# EAGLE design pcb-breakout-pan1740 (EAGLE 7.4.0)
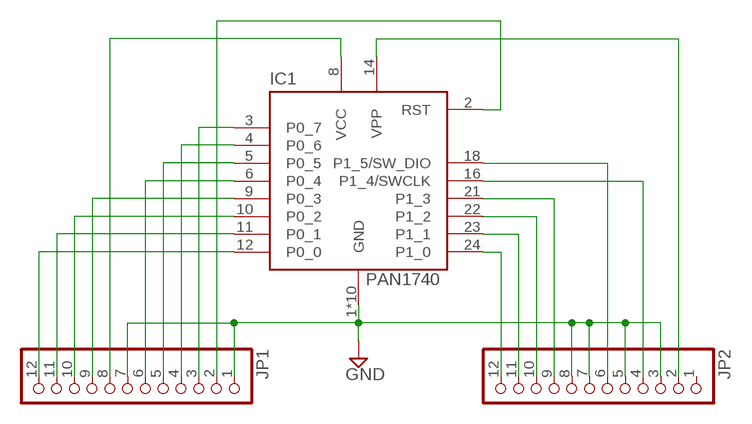
[diagram p0: schematic, sheet 1]

## Parts
IC1  PAN1740  [PAN1740]
JP1  PINHD-1X12  [1X12]
JP2  PINHD-1X12  [1X12]

## Nets
GND: IC1.1(GND) IC1.7(GND) IC1.15(GND) IC1.17(GND) IC1.19(GND) IC1.20(GND) IC1.A(GND) IC1.B(GND) IC1.C(GND) IC1.D(GND) JP1.1 JP1.7 JP2.3 JP2.5 JP2.7 JP2.8
N$2: IC1.2(RST) JP1.2
N$3: IC1.3(P0_7) JP1.3
N$4: IC1.4(P0_6) JP1.4
N$5: IC1.5(P0_5) JP1.5
N$6: IC1.6(P0_4) JP1.6
N$7: IC1.8(VCC) JP1.8
N$8: IC1.9(P0_3) JP1.9
N$9: IC1.10(P0_2) JP1.10
N$10: IC1.11(P0_1) JP1.11
N$11: IC1.12(P0_0) JP1.12
N$12: IC1.14(VPP) JP2.2
N$13: IC1.16(P1_4/SWCLK) JP2.4
N$14: IC1.18(P1_5/SW_DIO) JP2.6
N$15: IC1.21(P1_3) JP2.9
N$16: IC1.22(P1_2) JP2.10
N$17: IC1.23(P1_1) JP2.11
N$18: IC1.24(P1_0) JP2.12
Unconnected: JP2.1

## Library data of the parts
IC1 = panasonic-pan1740:PAN1740: Bluetooth Low Energy (BLE), also called Bluetooth Smart, is a part of Bluetooth Ver. 4.0, BT v4.0 covers both BLE as well as Classic Bluetooth v2.1 and v3.0. Bluetooth Low Energy (BLE) is not backwards compatible with previous Classic Bluetooth standards (v2.1+EDR or v3.0). Dual mode Bluetooth v4.0 is targeted to gateway products and backwards compatible, but is not practical for low power devices. The library has been designed by Richard Magdycz <https://www.facebook.com/groups/eaglecadsoftUK>
JP1 JP2 = pinhead:PINHD-1X12: PIN HEADER

## Board
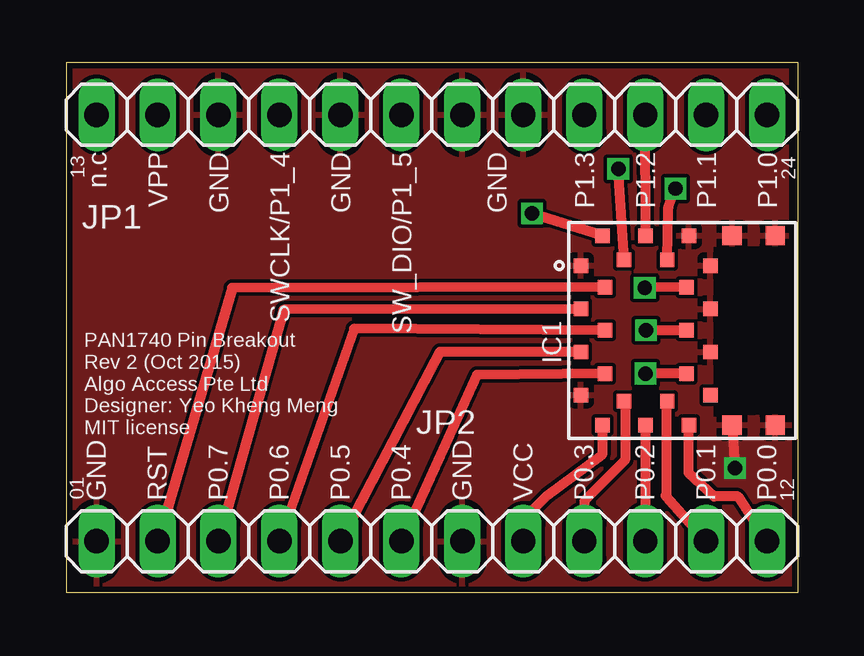
[diagram p1: board, top side]
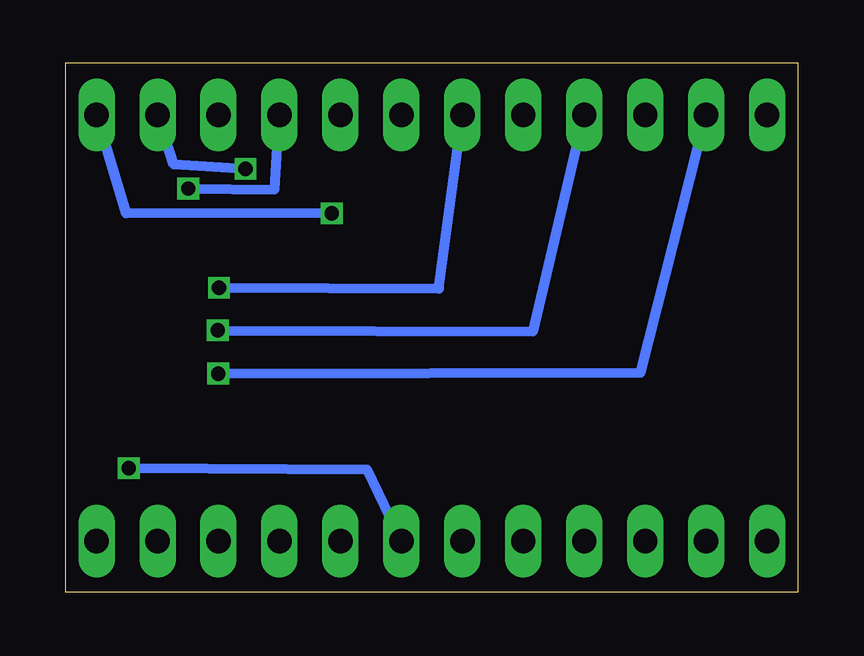
[diagram p2: board, bottom side, seen from below]

Size 30.5 x 22.1 mm. Coordinates in mm from the lower left corner, seen from the top.
Outline: 0,0 30.5,0 30.5,22.1 0,22.1 0,0
Copper layers (1*16): Top 0.035mm / dielectric 1.5mm / Bottom 0.035mm
Design rules "Elecrow_2-layer_eagle_rule": minimum track width 6mil, minimum drill 12mil, track to track 6mil, track to pad 6mil, pad to pad 6mil, via to via 6mil, smd to smd 0mil, copper to edge 10mil, drill to drill 10mil, minimum pad ring 10mil, minimum via ring 6mil, stop-mask expansion 2mil, vias tented up to drill 100mil, thermal gap 10mil

### Footprints (pad centres in the part's own frame; a part is rotated, then mirrored left to right if it is on the bottom)
PAN1740 = smd 0.6 x 0.6: 1 -4.2,2.7; 2 -3.2,1.8; 3 -4.2,0.9; 4 -3.2,0; 5 -4.2,-0.9; 6 -3.2,-1.8; 7 -4.2,-2.7; 8 -3.3,-3.95; 9 -2.4,-2.95; 10 -1.5,-3.95; 11 -0.6,-2.95; 12 0.3,-3.95; 13 1.2,-2.7; 14 0.2,-1.8; 15 1.2,-0.9; 16 0.2,0; 17 1.2,0.9; 18 0.2,1.8; 19 1.2,2.7; 20 0.3,3.95; 21 -0.6,2.95; 22 -1.5,3.95; 23 -2.4,2.95; 24 -3.3,3.95 | smd 0.8 x 0.8: A 2.1,3.95; B 2.1,-3.95; C 3.9,3.95; D 3.9,-3.95
1X12 = drill 1.016 long: 1 -13.97,0; 2 -11.43,0; 3 -8.89,0; 4 -6.35,0; 5 -3.81,0; 6 -1.27,0; 7 1.27,0; 8 3.81,0; 9 6.35,0; 10 8.89,0; 11 11.43,0; 12 13.97,0

### Placement (x,y rotation side)
IC1  25.65,10.93 0 top
JP1  15.24,2.14 0 top
JP2  15.24,19.92 0 top

### Tracks (layer width: path | path; a pad name or v marks a point on that pad's centre or on a via)
GND  (via drill 0.6)
  Top 0.406: IC1.B v27.87,5.19
  Bottom 0.406: v27.87,5.19 17.95,5.13 JP1.7
  pour Top: 0,22.1 30,22.1 30,14.53 26.87,14.48 26.87,7.24 30.13,7.39 30.13,0.1 0,0
N$2
  Top 0.406: IC1.2 6.92,12.7 JP1.2
N$3
  Top 0.406: IC1.3 9.06,11.79 JP1.3
N$4
  Top 0.406: IC1.4 12,11 JP1.4
N$5
  Top 0.406: IC1.5 15.57,10.03 JP1.5
N$6
  Top 0.406: IC1.6 17.12,9.08 JP1.6
N$7
  Top 0.406: IC1.8 22.33,6.96 22.33,5.74 20,4 19.05,3.05 JP1.8
N$8
  Top 0.406: IC1.9 23.29,7.94 23.29,5.52 21.59,3.82 JP1.9
N$9
  Top 0.406: IC1.10 24.13,6.96 JP1.10
N$10
  Top 0.406: IC1.11 25,7.93 25.01,4.01 | 24.98,4.04 25.01,4.01 | 25.01,4.01 JP1.11
N$11
  Top 0.406: JP1.12 28,4 27,4 25.94,4.99 IC1.12
N$12  (via drill 0.6)
  Top 0.406: IC1.14 v24.14,9.13
  Bottom 0.406: v24.14,9.13 6.54,9.17 JP2.2
N$13  (via drill 0.6)
  Top 0.406: IC1.16 v24.16,10.93
  Bottom 0.406: v24.16,10.93 11.02,10.89 JP2.4
N$14  (via drill 0.6)
  Top 0.406: IC1.18 v24.11,12.71
  Bottom 0.406: v24.11,12.71 14.95,12.67 JP2.6
N$15  (via drill 0.6)
  Top 0.406: IC1.21 25.1,16.07 v25.39,16.84
  Bottom 0.406: v25.39,16.84 21.79,16.8 JP2.9
N$16
  Top 0.406: IC1.22 JP2.10
N$17  (via drill 0.6)
  Top 0.406: IC1.23 v23.01,17.66
  Bottom 0.406: v23.01,17.66 25.99,17.85 JP2.11
N$18  (via drill 0.6)
  Top 0.406: IC1.24 v19.41,15.81
  Bottom 0.406: v19.41,15.81 27.98,15.82 JP2.12

### Text on the board
tPlace: 13 | n.c | VPP | GND | SWCLK/P1_4 | GND | SW_DIO/P1_5 | GND | P1.3 | P1.2 | P1.1 | P1.0 | 24 | PAN1740 Pin Breakout / Rev 2 (Oct 2015) / Algo Access Pte Ltd / Designer: Yeo Kheng Meng / MIT license | 01 | GND | RST | P0.7 | P0.6 | P0.5 | P0.4 | GND | VCC | P0.3 | P0.2 | P0.1 | P0.0 | 12